# Altium schematic sheet ESC.SchDoc
size A4; SheetNumber: 5; SheetTotal: 7
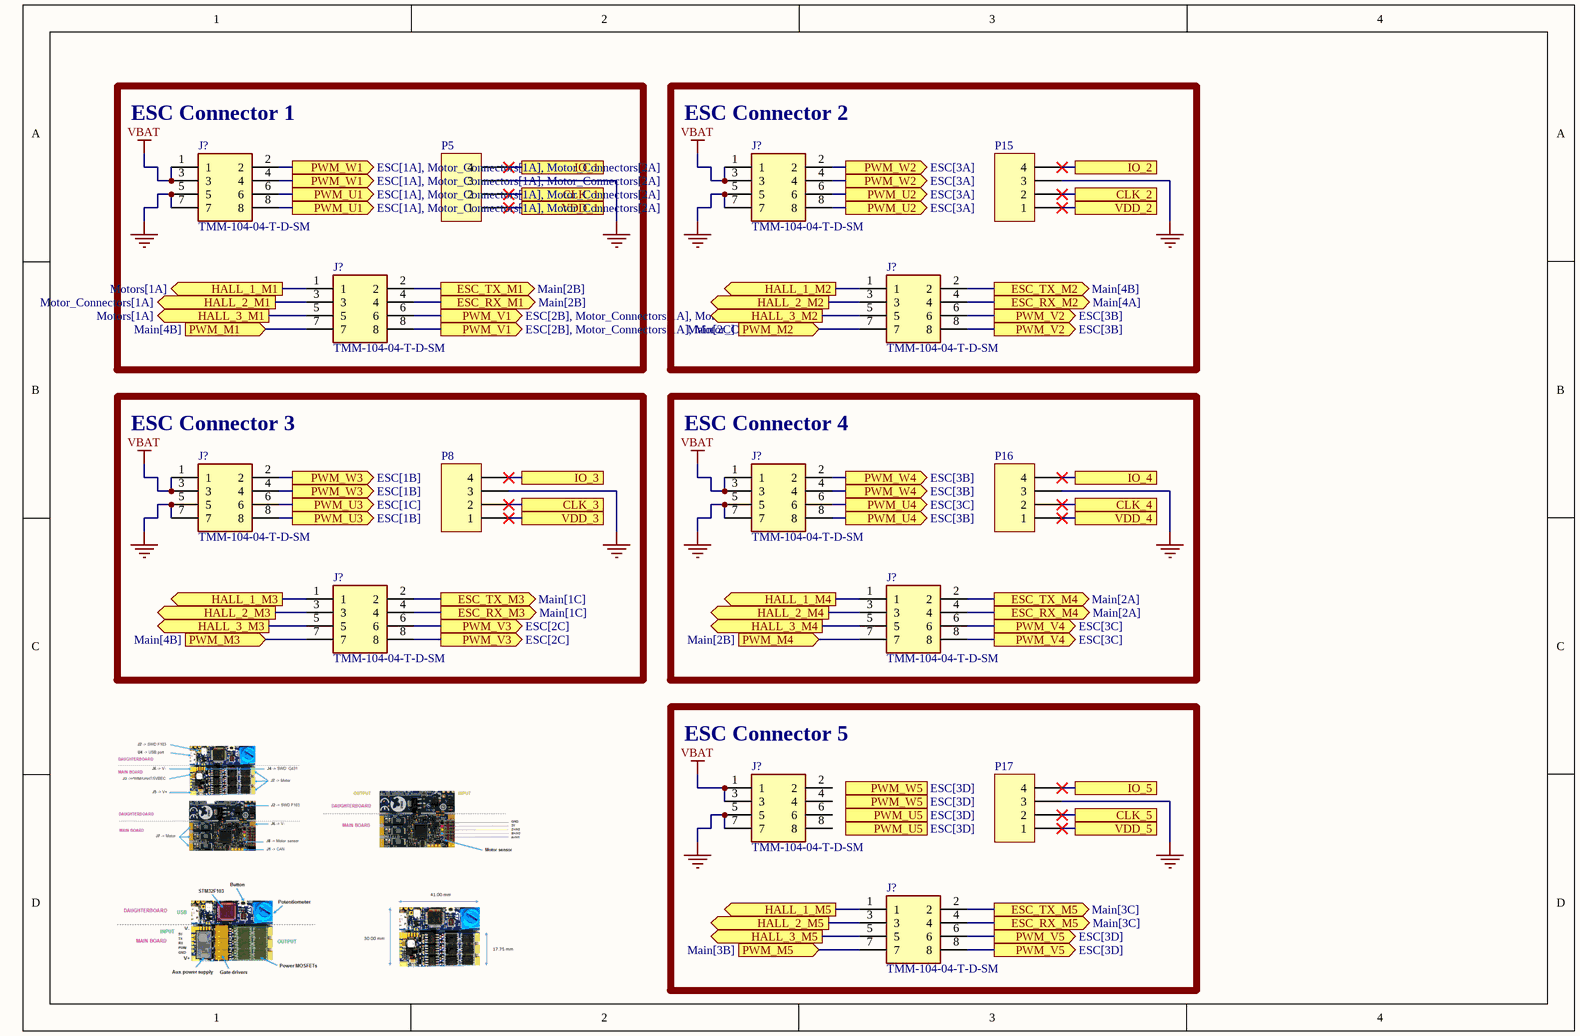
[diagram p0: ESC.SchDoc]

## Parts
(Parts that share a designator on the sheet are numbered #1, #2 ... from top to bottom, then left to right.)
J?#1  TMM-104-04-T-D-SM  [TMM-104-YY-XX-D-SM]
J?#2  TMM-104-04-T-D-SM  [TMM-104-YY-XX-D-SM]
J?#3  TMM-104-04-T-D-SM  [TMM-104-YY-XX-D-SM]
J?#4  TMM-104-04-T-D-SM  [TMM-104-YY-XX-D-SM]
J?#5  TMM-104-04-T-D-SM  [TMM-104-YY-XX-D-SM]
J?#6  TMM-104-04-T-D-SM  [TMM-104-YY-XX-D-SM]
J?#7  TMM-104-04-T-D-SM  [TMM-104-YY-XX-D-SM]
J?#8  TMM-104-04-T-D-SM  [TMM-104-YY-XX-D-SM]
J?#9  TMM-104-04-T-D-SM  [TMM-104-YY-XX-D-SM]
J?#10  TMM-104-04-T-D-SM  [TMM-104-YY-XX-D-SM]
P5  Header 3  [My_1X04]  (value not drawn)
P8  Header 3  [My_1X04]  (value not drawn)
P15  Header 3  [My_1X04]  (value not drawn)
P16  Header 3  [My_1X04]  (value not drawn)
P17  Header 3  [My_1X04]  (value not drawn)

## Blocks framed on the sheet
ESC Connector 1: J?#1 J?#3 P5
ESC Connector 2: J?#2 J?#4 P15
ESC Connector 3: J?#5 J?#7 P8
ESC Connector 4: J?#6 J?#8 P16
ESC Connector 5: J?#9 J?#10 P17

## Ports
CLK_1, CLK_2, CLK_3, CLK_4, CLK_5, ESC_RX_M1 (out, see Main[2B]), ESC_RX_M2 (out, see Main[4A]), ESC_RX_M3 (out, see Main[1C]), ESC_RX_M4 (out, see Main[2A]), ESC_RX_M5 (out, see Main[3C]), ESC_TX_M1 (out, see Main[2B]), ESC_TX_M2 (out, see Main[4B]), ESC_TX_M3 (out, see Main[1C]), ESC_TX_M4 (out, see Main[2A]), ESC_TX_M5 (out, see Main[3C]), HALL_1_M1 (out, see Motors[1A]), HALL_1_M2 (out), HALL_1_M3 (out), HALL_1_M4 (out), HALL_1_M5 (out), HALL_2_M1 (out, see Motor_Connectors[1A]), HALL_2_M2 (out), HALL_2_M3 (out), HALL_2_M4 (out), HALL_2_M5 (out), HALL_3_M1 (out, see Motors[1A]), HALL_3_M2 (out), HALL_3_M3 (out), HALL_3_M4 (out), HALL_3_M5 (out), IO_1, IO_2, IO_3, IO_4, IO_5, PWM_M1 (in, see Main[4B]), PWM_M2 (in, see Main[2C]), PWM_M3 (in, see Main[4B]), PWM_M4 (in, see Main[2B]), PWM_M5 (in, see Main[3B]), PWM_U1 (out, see ESC[1A], Motor_Connectors[1A], Motor_Connectors[2A]), PWM_U2 (out, see ESC[3A]), PWM_U3 (out, see ESC[1B]), PWM_U3 (out, see ESC[1C]), PWM_U4 (out, see ESC[3B]), PWM_U4 (out, see ESC[3C]), PWM_U5 (out, see ESC[3D]), PWM_V1 (out, see ESC[2B], Motor_Connectors[1A], Motor_Connectors[2A]), PWM_V2 (out, see ESC[3B]), PWM_V3 (out, see ESC[2C]), PWM_V4 (out, see ESC[3C]), PWM_V5 (out, see ESC[3D]), PWM_W1 (out, see ESC[1A], Motor_Connectors[1A], Motor_Connectors[2A]), PWM_W2 (out, see ESC[3A]), PWM_W3 (out, see ESC[1B]), PWM_W4 (out, see ESC[3B]), PWM_W5 (out, see ESC[3D]), VDD_1, VDD_2, VDD_3, VDD_4, VDD_5

## Nets
GND: J?#1.5 J?#1.7 J?#2.5 J?#2.7 J?#5.5 J?#5.7 J?#6.5 J?#6.7 J?#9.5 J?#9.7 P5.3 P8.3 P15.3 P16.3 P17.3
VBAT: J?#1.1 J?#1.3 J?#2.1 J?#2.3 J?#5.1 J?#5.3 J?#6.1 J?#6.3 J?#9.1 J?#9.3
CLK_1: P5.2 ; port CLK_1
CLK_2: P15.2 ; port CLK_2
CLK_3: P8.2 ; port CLK_3
CLK_4: P16.2 ; port CLK_4
CLK_5: P17.2 ; port CLK_5
ESC_RX_M1: J?#3.4 ; port ESC_RX_M1
ESC_RX_M2: J?#4.4 ; port ESC_RX_M2
ESC_RX_M3: J?#7.4 ; port ESC_RX_M3
ESC_RX_M4: J?#8.4 ; port ESC_RX_M4
ESC_RX_M5: J?#10.4 ; port ESC_RX_M5
ESC_TX_M1: J?#3.2 ; port ESC_TX_M1
ESC_TX_M2: J?#4.2 ; port ESC_TX_M2
ESC_TX_M3: J?#7.2 ; port ESC_TX_M3
ESC_TX_M4: J?#8.2 ; port ESC_TX_M4
ESC_TX_M5: J?#10.2 ; port ESC_TX_M5
HALL_1_M1: J?#3.1 ; port HALL_1_M1
HALL_1_M2: J?#4.1 ; port HALL_1_M2
HALL_1_M3: J?#7.1 ; port HALL_1_M3
HALL_1_M4: J?#8.1 ; port HALL_1_M4
HALL_1_M5: J?#10.1 ; port HALL_1_M5
HALL_2_M1: J?#3.3 ; port HALL_2_M1
HALL_2_M2: J?#4.3 ; port HALL_2_M2
HALL_2_M3: J?#7.3 ; port HALL_2_M3
HALL_2_M4: J?#8.3 ; port HALL_2_M4
HALL_2_M5: J?#10.3 ; port HALL_2_M5
HALL_3_M1: J?#3.5 ; port HALL_3_M1
HALL_3_M2: J?#4.5 ; port HALL_3_M2
HALL_3_M3: J?#7.5 ; port HALL_3_M3
HALL_3_M4: J?#8.5 ; port HALL_3_M4
HALL_3_M5: J?#10.5 ; port HALL_3_M5
IO_1: P5.4 ; port IO_1
IO_2: P15.4 ; port IO_2
IO_3: P8.4 ; port IO_3
IO_4: P16.4 ; port IO_4
IO_5: P17.4 ; port IO_5
PWM_M1: J?#3.7 ; port PWM_M1
PWM_M2: J?#4.7 ; port PWM_M2
PWM_M3: J?#7.7 ; port PWM_M3
PWM_M4: J?#8.7 ; port PWM_M4
PWM_M5: J?#10.7 ; port PWM_M5
PWM_U1: J?#1.6 J?#1.8 ; port PWM_U1
PWM_U2: J?#2.6 J?#2.8 ; port PWM_U2
PWM_U3: J?#5.6 J?#5.8 ; port PWM_U3
PWM_U4: J?#6.6 J?#6.8 ; port PWM_U4
PWM_V1: J?#3.6 J?#3.8 ; port PWM_V1
PWM_V2: J?#4.6 J?#4.8 ; port PWM_V2
PWM_V3: J?#7.6 J?#7.8 ; port PWM_V3
PWM_V4: J?#8.6 J?#8.8 ; port PWM_V4
PWM_V5: J?#10.6 J?#10.8 ; port PWM_V5
PWM_W1: J?#1.2 J?#1.4 ; port PWM_W1
PWM_W2: J?#2.2 J?#2.4 ; port PWM_W2
PWM_W3: J?#5.2 J?#5.4 ; port PWM_W3
PWM_W4: J?#6.2 J?#6.4 ; port PWM_W4
VDD_1: P5.1 ; port VDD_1
VDD_2: P15.1 ; port VDD_2
VDD_3: P8.1 ; port VDD_3
VDD_4: P16.1 ; port VDD_4
VDD_5: P17.1 ; port VDD_5

Not connected (* = marked no-connect by the designer): J?#9 2 4 6 8

## Library data of the parts
J?#1-J?#10 = TMM-104-04-T-D-SM: Connector; Manufacturer_Name: SAMTEC; Datasheet Link: http://suddendocs.samtec.com/prints/tmm-1xx-xx-xx-x-sm-xx-x-mkt.pdf; Manufacturer_Part_Number: TMM-104-04-T-D-SM
P5 P8 P15-P17 = Header 4_1: Header, 4-Pin; ASiD Part Number: Header 4-AS